# EAGLE schematic SparkFun_CAN-Bus_ShieldNodo3 (EAGLE 7.6.0)

## Sheet 1 of 2
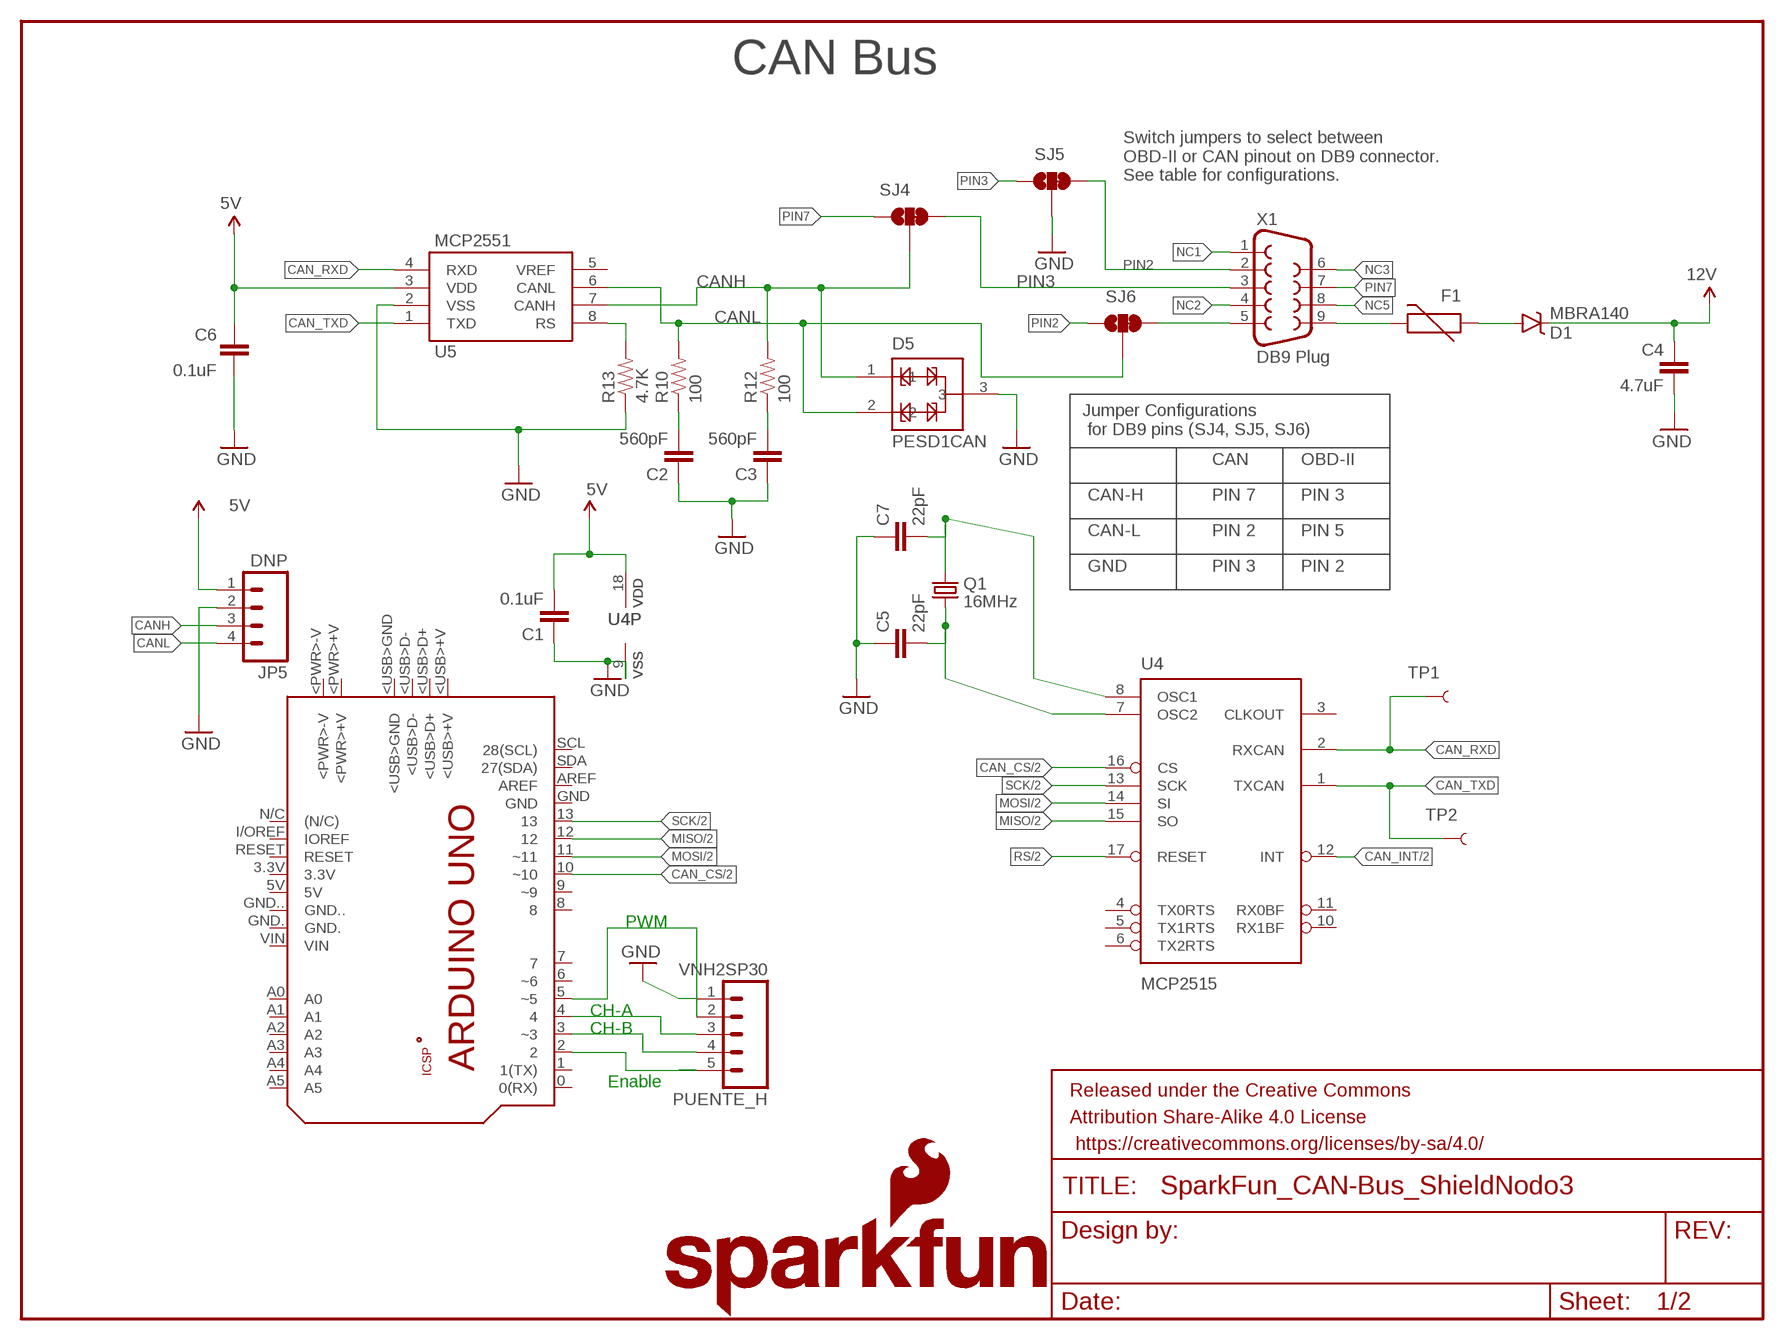
[diagram p0: schematic, sheet 1]

### Parts
C1  0.1uF  0.1UF-25V(+80/-20%)(0603)  [0603-CAP]
C2  560pF  560PF-50V-5%(0603)  [0603-CAP]
C3  560pF  560PF-50V-5%(0603)  [0603-CAP]
C4  4.7uF  4.7UF-6.3V-10%(0603)0603  [0603-CAP]
C5  22pF  22PF-50V-5%(0603)  [0603-CAP]
C6  0.1uF  0.1UF-25V(+80/-20%)(0603)  [0603-CAP]
C7  22pF  22PF-50V-5%(0603)  [0603-CAP]
D1  MBRA140  [SMA-DIODE]
D5  PESD1CAN  [SOT23-3]
F1  PTCTHERMISTOR1206  [PTC-1206]
FRAME1  FRAME-LETTER  [CREATIVE_COMMONS]
JP4  SFE_LOGO_NAME_FLAME.1_INCH  [SFE_LOGO_NAME_FLAME_.1]
JP5  DNP  M04PTH  [1X04]
PCB1  ARDUINO_UNO  [ARDUINO_UNO]
PUENTE_H  VNH2SP30  M05  [05P]
Q1  16MHz  CRYSTAL5X3  [CRYSTAL-SMD-5X3]
R10  100  100OHM-1/10W-1%(0603)  [0603-RES]
R12  100  100OHM-1/10W-1%(0603)  [0603-RES]
R13  4.7K  4.7KOHM-1/10W-1%(0603)  [0603-RES]
SJ4  JUMPER-PAD-3-2OF3_NC_BY_TRACE_SMALL  [PAD-JUMPER-3-2OF3_NC_BY_TRACE_YES_SILK_FULL_BOX]
SJ5  JUMPER-PAD-3-2OF3_NC_BY_TRACE_SMALL  [PAD-JUMPER-3-2OF3_NC_BY_TRACE_YES_SILK_FULL_BOX]
SJ6  JUMPER-PAD-3-2OF3_NC_BY_TRACE_SMALL  [PAD-JUMPER-3-2OF3_NC_BY_TRACE_YES_SILK_FULL_BOX]
TP1  TEST-POINT3X5  [PAD.03X.05]
TP2  TEST-POINT3X5  [PAD.03X.05]
U4  MCP2515  MCP2510SO  [SO-18W]
U5  MCP2551  [SO08]
X1  DB9 Plug  DB9MALE  [DB9_MALE]

### Nets
5V: C1.2 C6.2 JP5.1 U4.18(VDD) U5.3(VDD) ; also sheet 2
12V: C4.1 D1.C ; also sheet 2
CAN_CS: U4.16(CS) ; also sheet 2
CAN_INT: U4.12(INT) ; also sheet 2
CAN_RXD: TP1.P$1 U4.2(RXCAN) U5.4(RXD)
CAN_TXD: TP2.P$1 U4.1(TXCAN) U5.1(TXD)
CANH: D5.1 JP5.3 R12.2 SJ4.2 U5.7(CANH)
CANL: D5.2 JP5.4 R10.2 SJ6.2 U5.6(CANL)
GND: C1.1 C2.1 C3.1 C4.2 C5.1 C6.1 C7.1 D5.3 JP5.2 PUENTE_H.1 R13.1 SJ5.2 U4.9(VSS) U5.2(VSS) ; also sheet 2
MISO: U4.15(SO) ; also sheet 2
MOSI: U4.14(SI) ; also sheet 2
N$2: SJ6.3 X1.5
N$3: PCB1.4 PUENTE_H.3
N$7: PCB1.3(~3) PUENTE_H.4
N$8: PCB1.5(~5) PUENTE_H.2
N$9: C2.2 R10.1
N$10: C3.2 R12.1
N$11: PCB1.2 PUENTE_H.5
N$13: F1.2 X1.9
N$14: R13.2 U5.8(RS)
N$16: D1.A F1.1
N$17: C7.2 Q1.3 U4.8(OSC1)
N$18: C5.2 Q1.1 U4.7(OSC2)
NC1: X1.1
NC2: X1.4
NC3: X1.6
NC5: X1.8
PIN2: SJ5.3 SJ6.1 X1.2
PIN3: SJ4.3 SJ5.1 X1.3
PIN7: SJ4.1 X1.7
RS: U4.17(RESET) ; also sheet 2
SCK: U4.13(SCK) ; also sheet 2
Unconnected: PCB1.0(0(RX)) PCB1.1(1(TX)) PCB1.3.3V PCB1.5V PCB1.6(~6) PCB1.7 PCB1.8 PCB1.9(~9) PCB1.10(~10) PCB1.11(~11) PCB1.12 PCB1.13 PCB1.+5V PCB1.<PWR>+V PCB1.<PWR>-V PCB1.<USB>+V PCB1.<USB>D+ PCB1.<USB>D- PCB1.<USB>GND PCB1.A0 PCB1.A1 PCB1.A2 PCB1.A3 PCB1.A4 PCB1.A5 PCB1.AREF PCB1.GND PCB1.GND. PCB1.GND.. PCB1.GND_ PCB1.I/OREF(IOREF) PCB1.MISO PCB1.MOSI PCB1.N/C((N/C)) PCB1.RESET PCB1.RESET. PCB1.SCK PCB1.SCL(28(SCL)) PCB1.SDA(27(SDA)) PCB1.VIN U4.3(CLKOUT) U4.4(TX0RTS) U4.5(TX1RTS) U4.6(TX2RTS) U4.10(RX1BF) U4.11(RX0BF) U5.5(VREF)

### Notes on the sheet
- CAN Bus
- Switch jumpers to select between 
  OBD-II or CAN pinout on DB9 connector. 
  See table for configurations.
- Jumper Configurations
   for DB9 pins (SJ4, SJ5, SJ6)
- CAN | OBD-II
- CAN-H | PIN 7 | PIN 3
- CAN-L | PIN 2 | PIN 5
- GND | PIN 3 | PIN 2
- PWM
- CH-A
- CH-B
- Enable

## Sheet 2 of 2
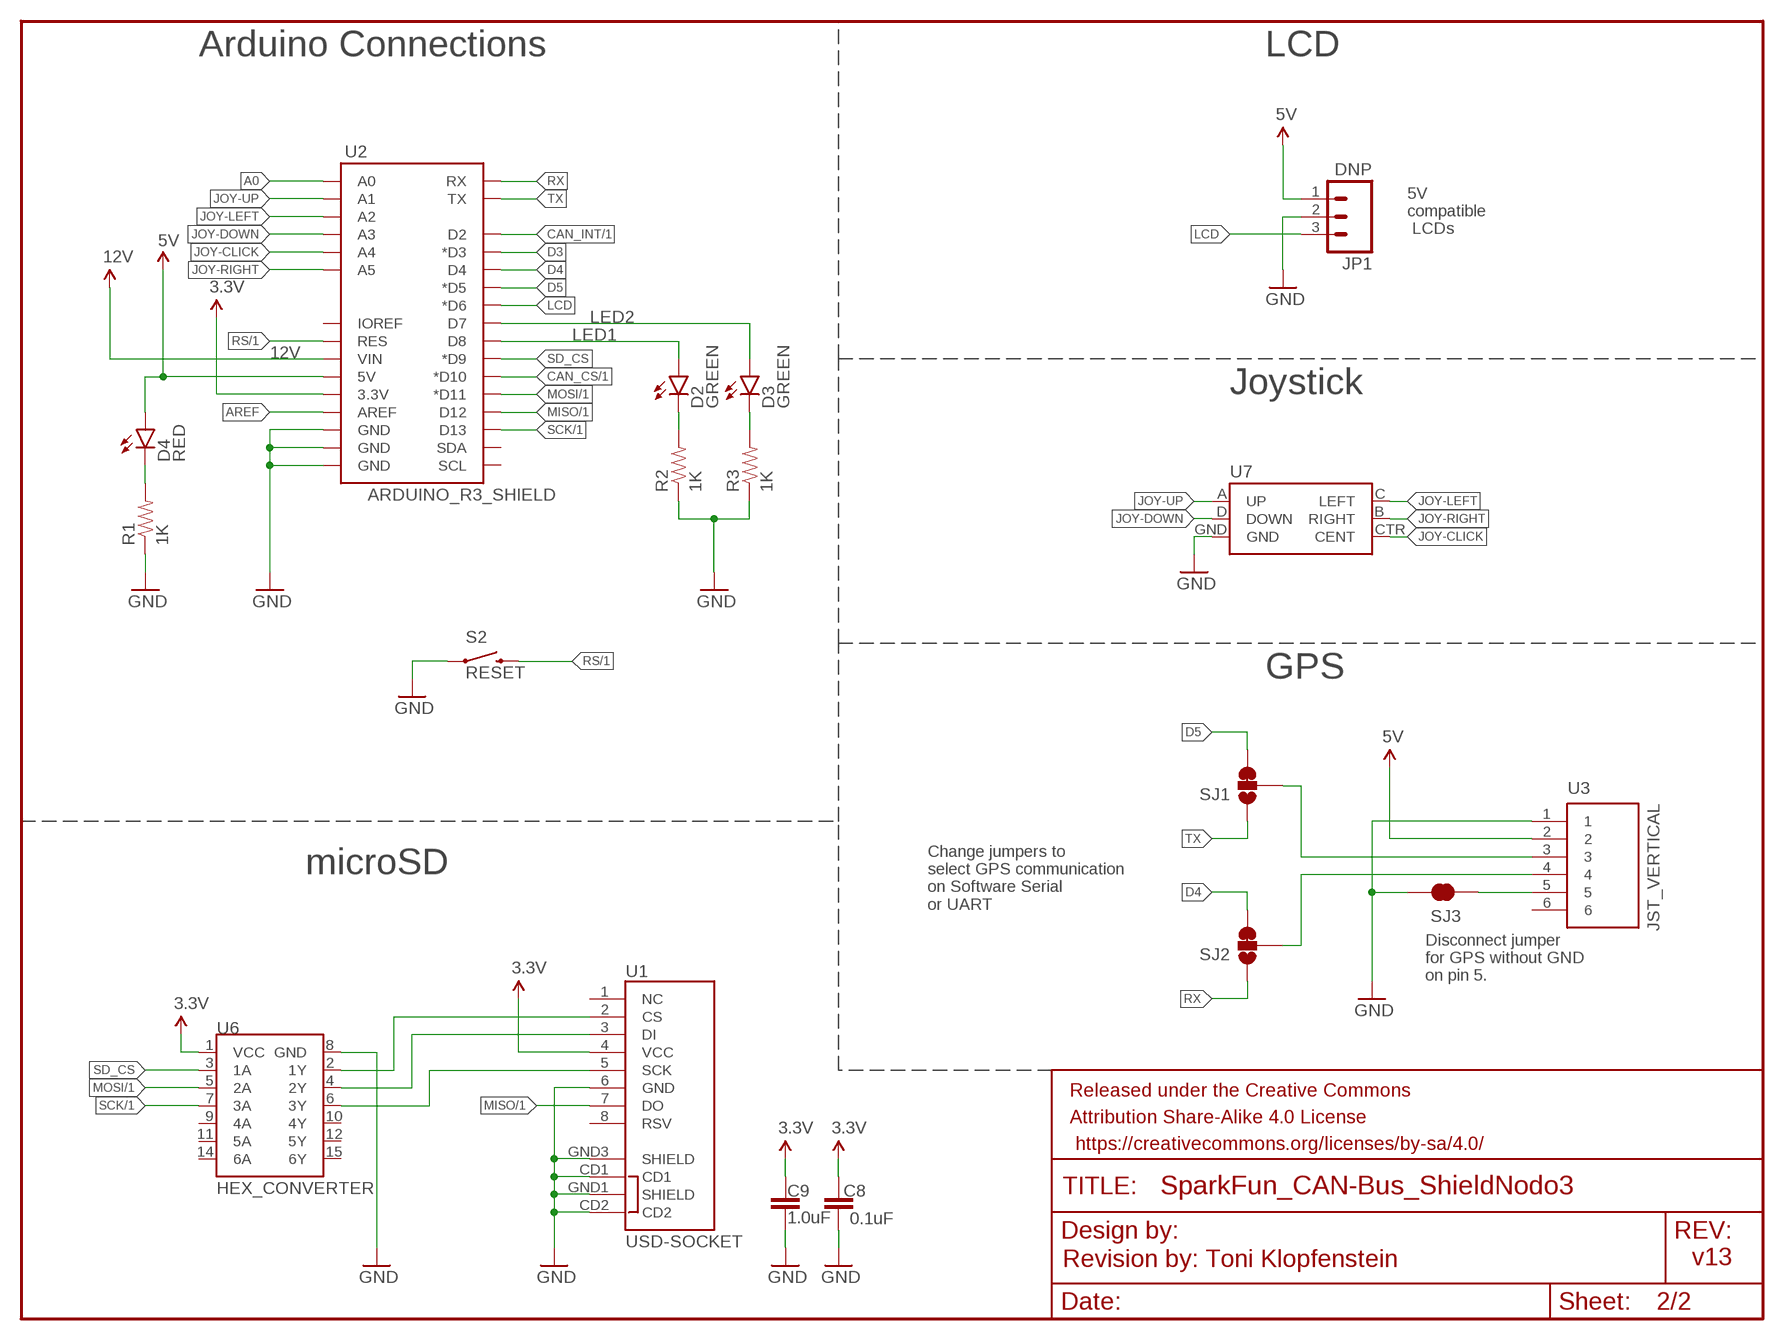
[diagram p1: schematic, sheet 2]

### Parts
C8  0.1uF  0.1UF-25V(+80/-20%)(0603)  [0603-CAP]
C9  1.0uF  1.0UF-16V-10%(0603)  [0603-CAP]
D2  GREEN  LED-GREEN0603  [LED-0603]
D3  GREEN  LED-GREEN0603  [LED-0603]
D4  RED  LED-RED0603  [LED-0603]
FRAME2  FRAME-LETTERNO_PACKAGE  [DUMMY]
JP1  DNP  M03POLAR_LOCK  [MOLEX-1X3_LOCK]
R1  1K  1KOHM-1/10W-1%(0603)  [0603-RES]
R2  1K  1KOHM-1/10W-1%(0603)  [0603-RES]
R3  1K  1KOHM-1/10W-1%(0603)  [0603-RES]
S2  RESET  SWITCH-MOMENTARY-2SMD  [TACTILE-SWITCH-SMD]
SJ1  JUMPER-PAD-3-2OF3_NC_BY_TRACE_SMALL  [PAD-JUMPER-3-2OF3_NC_BY_TRACE_YES_SILK_FULL_BOX]
SJ2  JUMPER-PAD-3-2OF3_NC_BY_TRACE_SMALL  [PAD-JUMPER-3-2OF3_NC_BY_TRACE_YES_SILK_FULL_BOX]
SJ3  JUMPER-PAD-2-NC_BY_TRACE  [PAD-JUMPER-2-NC_BY_TRACE_YES_SILK]
U1  USD-SOCKET  [MICROSD_1:1]
U2  ARDUINO_R3_SHIELD  [UNO_R3_SHIELD]
U3  JST_VERTICAL  [JST-6-SMD-VERT-1.0MM]
U6  HEX_CONVERTER  [SO016]
U7  JOYSTICK_MINI  [JOYSTICK_MINI]

### Nets
3.3V: C8.2 C9.1 U1.4(VCC) U2.3.3V U6.1(VCC)
5V: D4.A JP1.1 U2.5V U3.2 ; also sheet 1
12V: U2.VIN ; also sheet 1
A0: U2.A0
AREF: U2.AREF
CAN_CS: U2.D10(*D10) ; also sheet 1
CAN_INT: U2.D2 ; also sheet 1
D3: U2.D3(*D3)
D4: SJ2.3 U2.D4
D5: SJ1.3 U2.D5(*D5)
GND: C8.1 C9.2 JP1.2 R1.1 R2.1 R3.1 S2.1 SJ3.2 U1.6(GND) U1.CD1 U1.CD2 U1.GND1(SHIELD) U1.GND3(SHIELD) U2.GND@0(GND) U2.GND@1(GND) U2.GND@2(GND) U3.1 U6.8(GND) U7.GND ; also sheet 1
JOY-CLICK: U2.A4 U7.CTR(CENT)
JOY-DOWN: U2.A3 U7.D(DOWN)
JOY-LEFT: U2.A2 U7.C(LEFT)
JOY-RIGHT: U2.A5 U7.B(RIGHT)
JOY-UP: U2.A1 U7.A(UP)
LCD: JP1.3 U2.D6(*D6)
LED1: D2.A U2.D8
LED2: D3.A U2.D7
MISO: U1.7(DO) U2.D12 ; also sheet 1
MOSI: U2.D11(*D11) U6.5(2A) ; also sheet 1
N$1: SJ3.1 U3.5
N$4: D4.C R1.2
N$5: D2.C R2.2
N$6: D3.C R3.2
N$15: U1.2(CS) U6.2(1Y)
N$19: U1.3(DI) U6.4(2Y)
N$21: SJ1.2 U3.3
N$22: SJ2.2 U3.4
N$24: U1.5(SCK) U6.6(3Y)
RS: S2.3 U2.RES ; also sheet 1
RX: SJ2.1 U2.RX
SCK: U2.D13 U6.7(3A) ; also sheet 1
SD_CS: U2.D9(*D9) U6.3(1A)
TX: SJ1.1 U2.TX
Unconnected: U1.1(NC) U1.8(RSV) U2.IOREF U2.SCL U2.SDA U3.6 U6.9(4A) U6.10(4Y) U6.11(5A) U6.12(5Y) U6.14(6A) U6.15(6Y)

### Notes on the sheet
- Arduino Connections | LCD
- 5V 
  compatible
   LCDs
- Joystick
- GPS
- microSD
- Change jumpers to 
  select GPS communication
  on Software Serial 
  or UART
- Disconnect jumper
  for GPS without GND
  on pin 5.
- Revision by: Toni Klopfenstein | v13

## Library data of the parts
C1 C6 C8 = SparkFun-Capacitors:0.1UF-25V(+80/-20%)(0603): CAP-00810 Ceramic Standard decoupling cap; PROD_ID: CAP-00810
C2 C3 = SparkFun-Capacitors:560PF-50V-5%(0603): CAP-08749; PROD_ID: CAP-08749
C4 = SparkFun-Capacitors:4.7UF-6.3V-10%(0603): CAP-08280; PROD_ID: CAP-08280
C5 C7 = SparkFun-Capacitors:22PF-50V-5%(0603): CAP-07876; PROD_ID: CAP-07876
C9 = SparkFun-Capacitors:1.0UF-16V-10%(0603): CAP-00868; PROD_ID: CAP-00868
D1 = SparkFun-DiscreteSemi:MBRA140: 40V, 1A Schottky rectifier SMA/DO-214AC package DIO-08053; PROD_ID: DIO-08053
D2 D3 = SparkFun-LED:LED-GREEN: Various green LEDs Green LEDs used in SFE Production 0603- DIO-00821 LARGE- DIO-00862 LILYPAD- DIO-09910; PROD_ID: DIO-00821
D4 = SparkFun-LED:LED-RED: Assorted Red LEDs LilyPad 1206- DIO-09912 1206- DIO-00809 0603- DIO-00819 "SMART" means more efficient and expensive; PROD_ID: DIO-00819
D5 = SparkFun-DiscreteSemi:PESD1CAN: PESD1CAN is used to protect two automotive CAN bus lines from ESD.; PROD_ID: DIO-12501
F1 = SparkFun-PowerIC:PTC: Resettable Fuse PTC Resettable Fuse. Spark Fun Electronics SKU : COM-08357; PROD_ID: RES-08585
FRAME1 = SparkFun-Aesthetics:FRAME-LETTER: Schematic Frame Standard 8.5x11 US Letter frame
FRAME2 = SparkFun-Aesthetics:FRAME-LETTER: Schematic Frame Standard 8.5x11 US Letter frame; DESIGNER: Sukkin Pang and Ryan Owens; VERSION: v13
JP1 = SparkFun-Connectors:M03: Header 3 Standard 3-pin 0.1" header. Use with straight break away headers (SKU : PRT-00116), right angle break away headers (PRT-00553), swiss pins (PRT-00743), machine pins (PRT-00117), and female headers (PRT-00115). Molex polarized connector foot print use with SKU : PRT-08232 with associated crimp pins and housings.
JP4 = SparkFun-Aesthetics:SFE_LOGO_NAME_FLAME: SFE Logo, name and flame This is the SparkFun full logo. The logo on the schematic will always be the same size; the package variant is the height of the flame part of the logo. Default layer for the logo on the board is tSilk.
JP5 = SparkFun-Connectors:M04: Header 4 Standard 4-pin 0.1" header. Use with straight break away headers (SKU : PRT-00116), right angle break away headers (PRT-00553), swiss pins (PRT-00743), machine pins (PRT-00117), and female headers (PRT-00115). Molex polarized connector foot print use with SKU : PRT-08231 with associated crimp pins and housings. 1MM SMD Version SKU: PRT-10208
PCB1 = E14_Arduino_revC:ARDUINO_UNO: Device for representing an Arduino Uno board with a footprint in an EAGLE design. Created by Dave Young for Element14. More EAGLE documentation at: http://www.element14.com/community/community/knode/cadsoft_eagle
PUENTE_H = con-amp-quick:M05: AMP QUICK CONNECTOR; OC_FARNELL: unknown; OC_NEWARK: unknown
Q1 = SparkFun-FreqCtrl:CRYSTAL: Various standard crystals. Proven footprints.; PROD_ID: XTAL-08218
R1-R3 = SparkFun-Resistors:1KOHM-1/10W-1%(0603): RES-07856; PROD_ID: RES-07856
R10 R12 = SparkFun-Resistors:100OHM-1/10W-1%(0603): RES-07863; PROD_ID: RES-07863
R13 = SparkFun-Resistors:4.7KOHM-1/10W-1%(0603): RES-07857; PROD_ID: RES-07857
S2 = SparkFun-Electromechanical:SWITCH-MOMENTARY-2: Various NO switches- pushbuttons, reed, etc; PROD_ID: SWCH-08247
SJ1 SJ2 SJ4-SJ6 = SparkFun-Passives:JUMPER-PAD-3-2OF3_NC_BY_TRACE
SJ3 = SparkFun-Passives:JUMPER-PAD-2-NC_BY_TRACE
TP1 TP2 = SparkFun-Passives:TEST-POINT: Bare copper test points for troubleshooting or ICT
U1 = SparkFun-Connectors:USD-SOCKET: microSD Socket Push-push type uSD socket. Schematic element and footprint production proven. Spark Fun Electronics SKU : PRT-00127. tDoc lines correctly indicate media card edge positions when inserting (unlocked, locked, depressed). NOTE: CD1 and CD2 are connected internally; PROD_ID: CONN-07820
U2 = SparkFun-Boards:ARDUINO_R3_SHIELD: Shield form compatible with the Arduino Uno R3.
U3 = SparkFun-Connectors:JST_VERTICAL; PROD_ID: CONN-08249
U4 = SparkFun-DigitalIC:MCP2510: CAN controller with SPI interface to any MCU. Original design by Microchip.; PROD_ID: IC-09906
U5 = SparkFun-DigitalIC:MCP2551: CAN transceiver; PROD_ID: IC-09907
U6 = SparkFun-DigitalIC:HEX_CONVERTER: 74HC4050 Hex Buffer Level Shifter SMD SO016; PROD_ID: IC-09604
U7 = SparkFun-Electromechanical:JOYSTICK_MINI: Small 5-way tactile joystick, COM-10063 4UCON SF303GJ26; PROD_ID: SWCH-09905
X1 = SparkFun-Connectors:DB9: DB9 Connector Standard DB9 (D-Sub 9) serial connector. Can be used for CAN bus as well as RS485 and RS232. Footprint production proven. Spark Fun Electronics SKU : PRT-00429; PROD_ID: CONN-09904